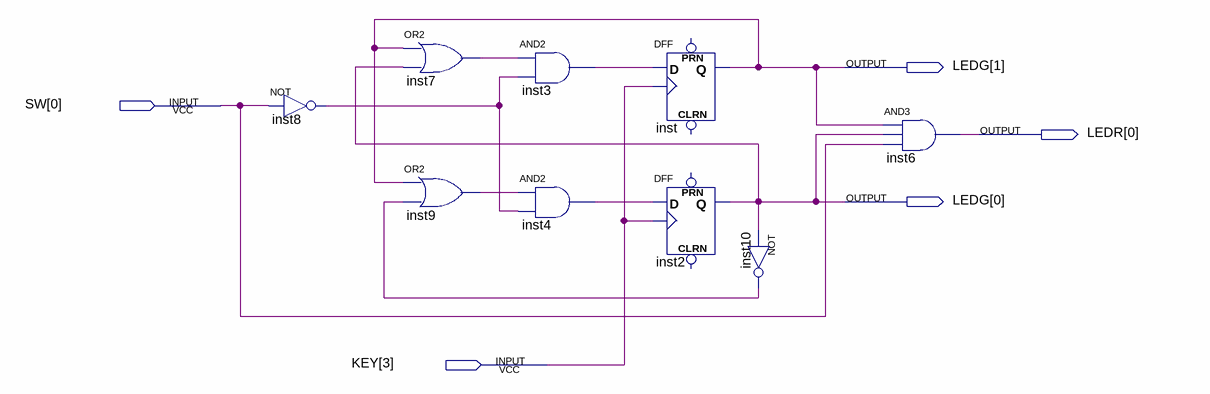
[diagram p0: schematic sheet]
// Quartus schematic LAB2_Mealy.bdf as structural Verilog: 9 symbols, 5 pins
module LAB2_Mealy (
  input  [0:0] SW,
  input  [3:3] KEY,
  output [1:0] LEDG,
  output [0:0] LEDR
);

  wire inst3_out, inst4_out, inst7_out, inst8_out, inst9_out, inst10_out;

  not inst8 (inst8_out, SW[0]);
  or inst7 (inst7_out, LEDG[1], LEDG[0]);
  or inst9 (inst9_out, LEDG[1], inst10_out);
  and inst3 (inst3_out, inst7_out, inst8_out);
  and inst4 (inst4_out, inst9_out, inst8_out);
  DFF inst (.CLK(KEY[3]), .D(inst3_out), .Q(LEDG[1]));  // open: CLRN, PRN
  DFF inst2 (.CLK(KEY[3]), .D(inst4_out), .Q(LEDG[0]));  // open: CLRN, PRN
  not inst10 (inst10_out, LEDG[0]);
  and inst6 (LEDR[0], LEDG[1], LEDG[0], SW[0]);
endmodule
